# Altium schematic sheet Power.SchDoc
size A4
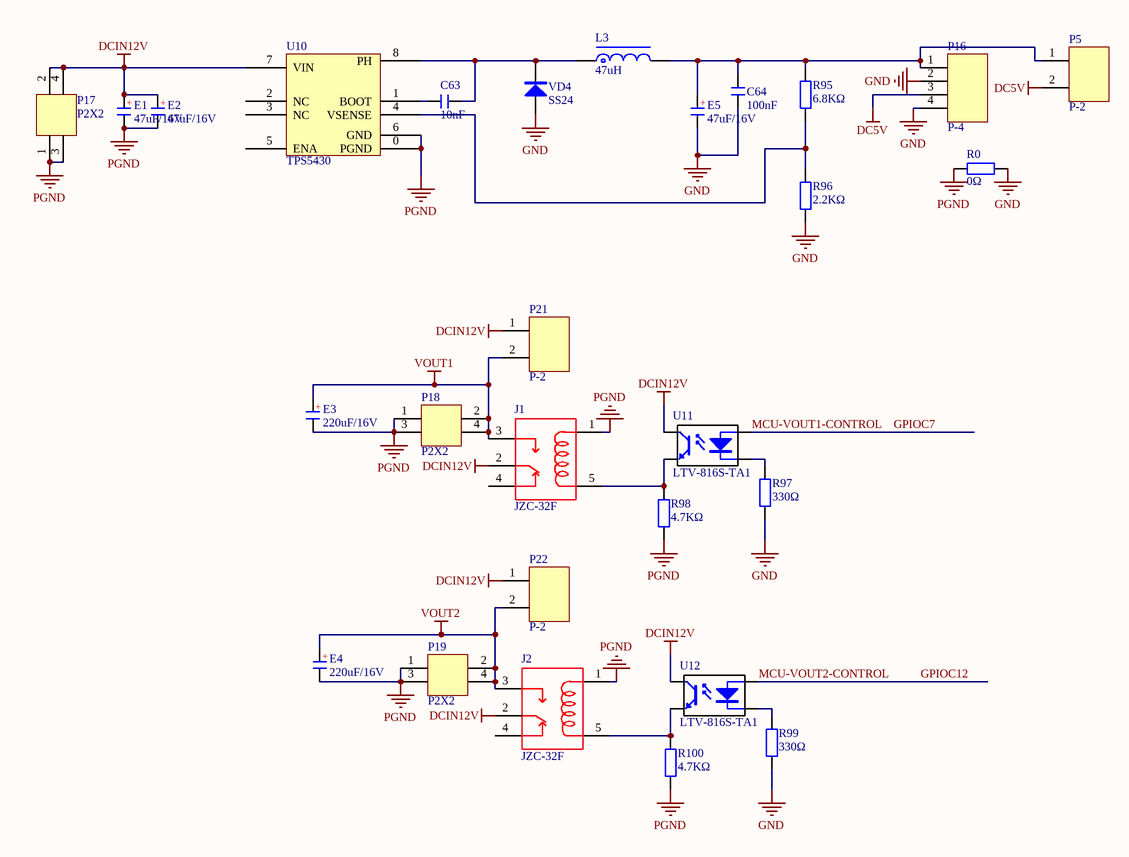
[diagram p0: Power.SchDoc]

## Parts
C63  10nF  [C 0603]
C64  100nF  [C 0603]
E1  47uF/16V  [CD C(6032)]
E2  47uF/16V  [CD C(6032)]
E3  220uF/16V  [CD E(7343H)]
E4  220uF/16V  [CD E(7343H)]
E5  47uF/16V  [CD C(6032)]
J1  JZC-32F  [RELAY-ThroughHole]
J2  JZC-32F  [RELAY-ThroughHole]
L3  47uH  [L CD75]
P5  P-2  [P HDR2.54-1X2]
P16  P-4  [P XH2.54-4]
P17  P2X2  [P 5557ATX4.2-2X2H]
P18  P2X2  [P 5557ATX4.2-2X2H]
P19  P2X2  [P 5557ATX4.2-2X2H]
P21  P-2  [P HDR2.54-1X2]
P22  P-2  [P HDR2.54-1X2]
R0  0Ω  [R 0805]
R95  6.8KΩ  [R 0603]
R96  2.2KΩ  [R 0603]
R97  330Ω  [R 0805]
R98  4.7KΩ  [R 0603]
R99  330Ω  [R 0805]
R100  4.7KΩ  [R 0603]
U10  TPS5430  [SOP8-EP]
U11  LTV-816S-TA1  [Optocoupler-SMD4]
U12  LTV-816S-TA1  [Optocoupler-SMD4]
VD4  SS24  [D SMB]

## Nets
DC5V: P5.2 P16.3
DCIN12V: E1.A(+) E2.A(+) J1.2(IN-) J2.2(IN-) P17.2 P17.4 P21.1 P22.1 U10.7(VIN) U11.4 U12.4
GND: C64.1 E5.K(-) P16.2 P16.4 R0.2 R96.1 R97.1 R99.1 VD4.A
PGND: E1.K(-) E2.K(-) E3.K(-) E4.K(-) J1.1(OUT+) J2.1(OUT+) P17.1 P17.3 P18.1 P18.3 P19.1 P19.3 R0.1 R98.1 R100.1 U10.0(PGND) U10.6(GND)
VOUT1: E3.A(+) J1.3(IN+) P18.2 P18.4 P21.2
VOUT2: E4.A(+) J2.3(IN+) P19.2 P19.4 P22.2
GPIOC7: U11.1  [also labelled MCU-VOUT1-CONTROL]
GPIOC12: U12.1  [also labelled MCU-VOUT2-CONTROL]
NetC63_1: C63.1 U10.1(BOOT)
NetC63_2: C63.2 L3.1 U10.8(PH) VD4.K
NetC64_2: C64.2 E5.A(+) L3.2 P5.1 P16.1 R95.2
NetJ1_5: J1.5(OUT-) R98.2 U11.3
NetJ2_5: J2.5(OUT-) R100.2 U12.3
NetR95_1: R95.1 R96.2 U10.4(VSENSE)
NetR97_2: R97.2 U11.2
NetR99_2: R99.2 U12.2

Not connected (* = marked no-connect by the designer): J1 4(IN-); J2 4(IN-); U10 2(NC) 3(NC) 5(ENA)

## Library data of the parts
C63 = C 10nF: 无极性贴片电容; 版权归属: 源创客; BOM名称: 无极性贴片电容; 学习资源: www.ooocke.com
C64 = C 100nF: 无极性贴片电容; 版权归属: 源创客; BOM名称: 无极性贴片电容; 学习资源: www.ooocke.com
E1 E2 E5 = C-CD 47uF/16V: 贴片钽电容; 版权归属: 源创客; BOM名称: 贴片钽电容; 学习资源: www.ooocke.com
E3 E4 = C-CD 220uF/16V: 贴片钽电容; 版权归属: 源创客; BOM名称: 贴片钽电容; 学习资源: www.ooocke.com
J1 J2 = RELAY JZC-32F: 继电器12V10A
L3 = L-CD  47uH: 贴片功率电感; BOM名称: 功率电感; 版权归属: 源创客; 学习资源: www.ooocke.com
P5 P21 P22 = P-2: 2脚接插件
P16 = P-4: 4脚接插件
P17-P19 = P-2X2: 2X2脚接插件
R0 = R 0Ω: 贴片电阻; 版权归属: 源创客; BOM名称: 贴片电阻; 学习资源: www.ooocke.com
R95 = R 6.8KΩ: 贴片电阻; 版权归属: 源创客; BOM名称: 贴片电阻; 学习资源: www.ooocke.com
R96 = R 2.2KΩ: 贴片电阻; 版权归属: 源创客; BOM名称: 贴片电阻; 学习资源: www.ooocke.com
R97 R99 = R 330Ω: 贴片电阻; 版权归属: 源创客; BOM名称: 贴片电阻; 学习资源: www.ooocke.com
R98 R100 = R 4.7KΩ: 贴片电阻; 版权归属: 源创客; BOM名称: 贴片电阻; 学习资源: www.ooocke.com
U10 = TPS5430: DCDC芯片3A; ComponentLink1Description: 供应商链接; ComponentLink1URL: http://www.szlcsc.com/product/details_15539.html; Package: SOIC-8_150mil; Supplier: LC; 商品编号: G0094
U11 U12 = Optocoupler LTV-816S-TA1: 光耦芯片; Value: TLP521; 商品编号: G0127
VD4 = SS24: 肖特基二极管; 版权归属: 源创客; 属性: 40V/2A; BOM名称: 肖特基二极管; 学习资源: www.ooocke.com